# EAGLE design Kappa R1 (EAGLE 9.2.2)

## Sheet 1 of 2
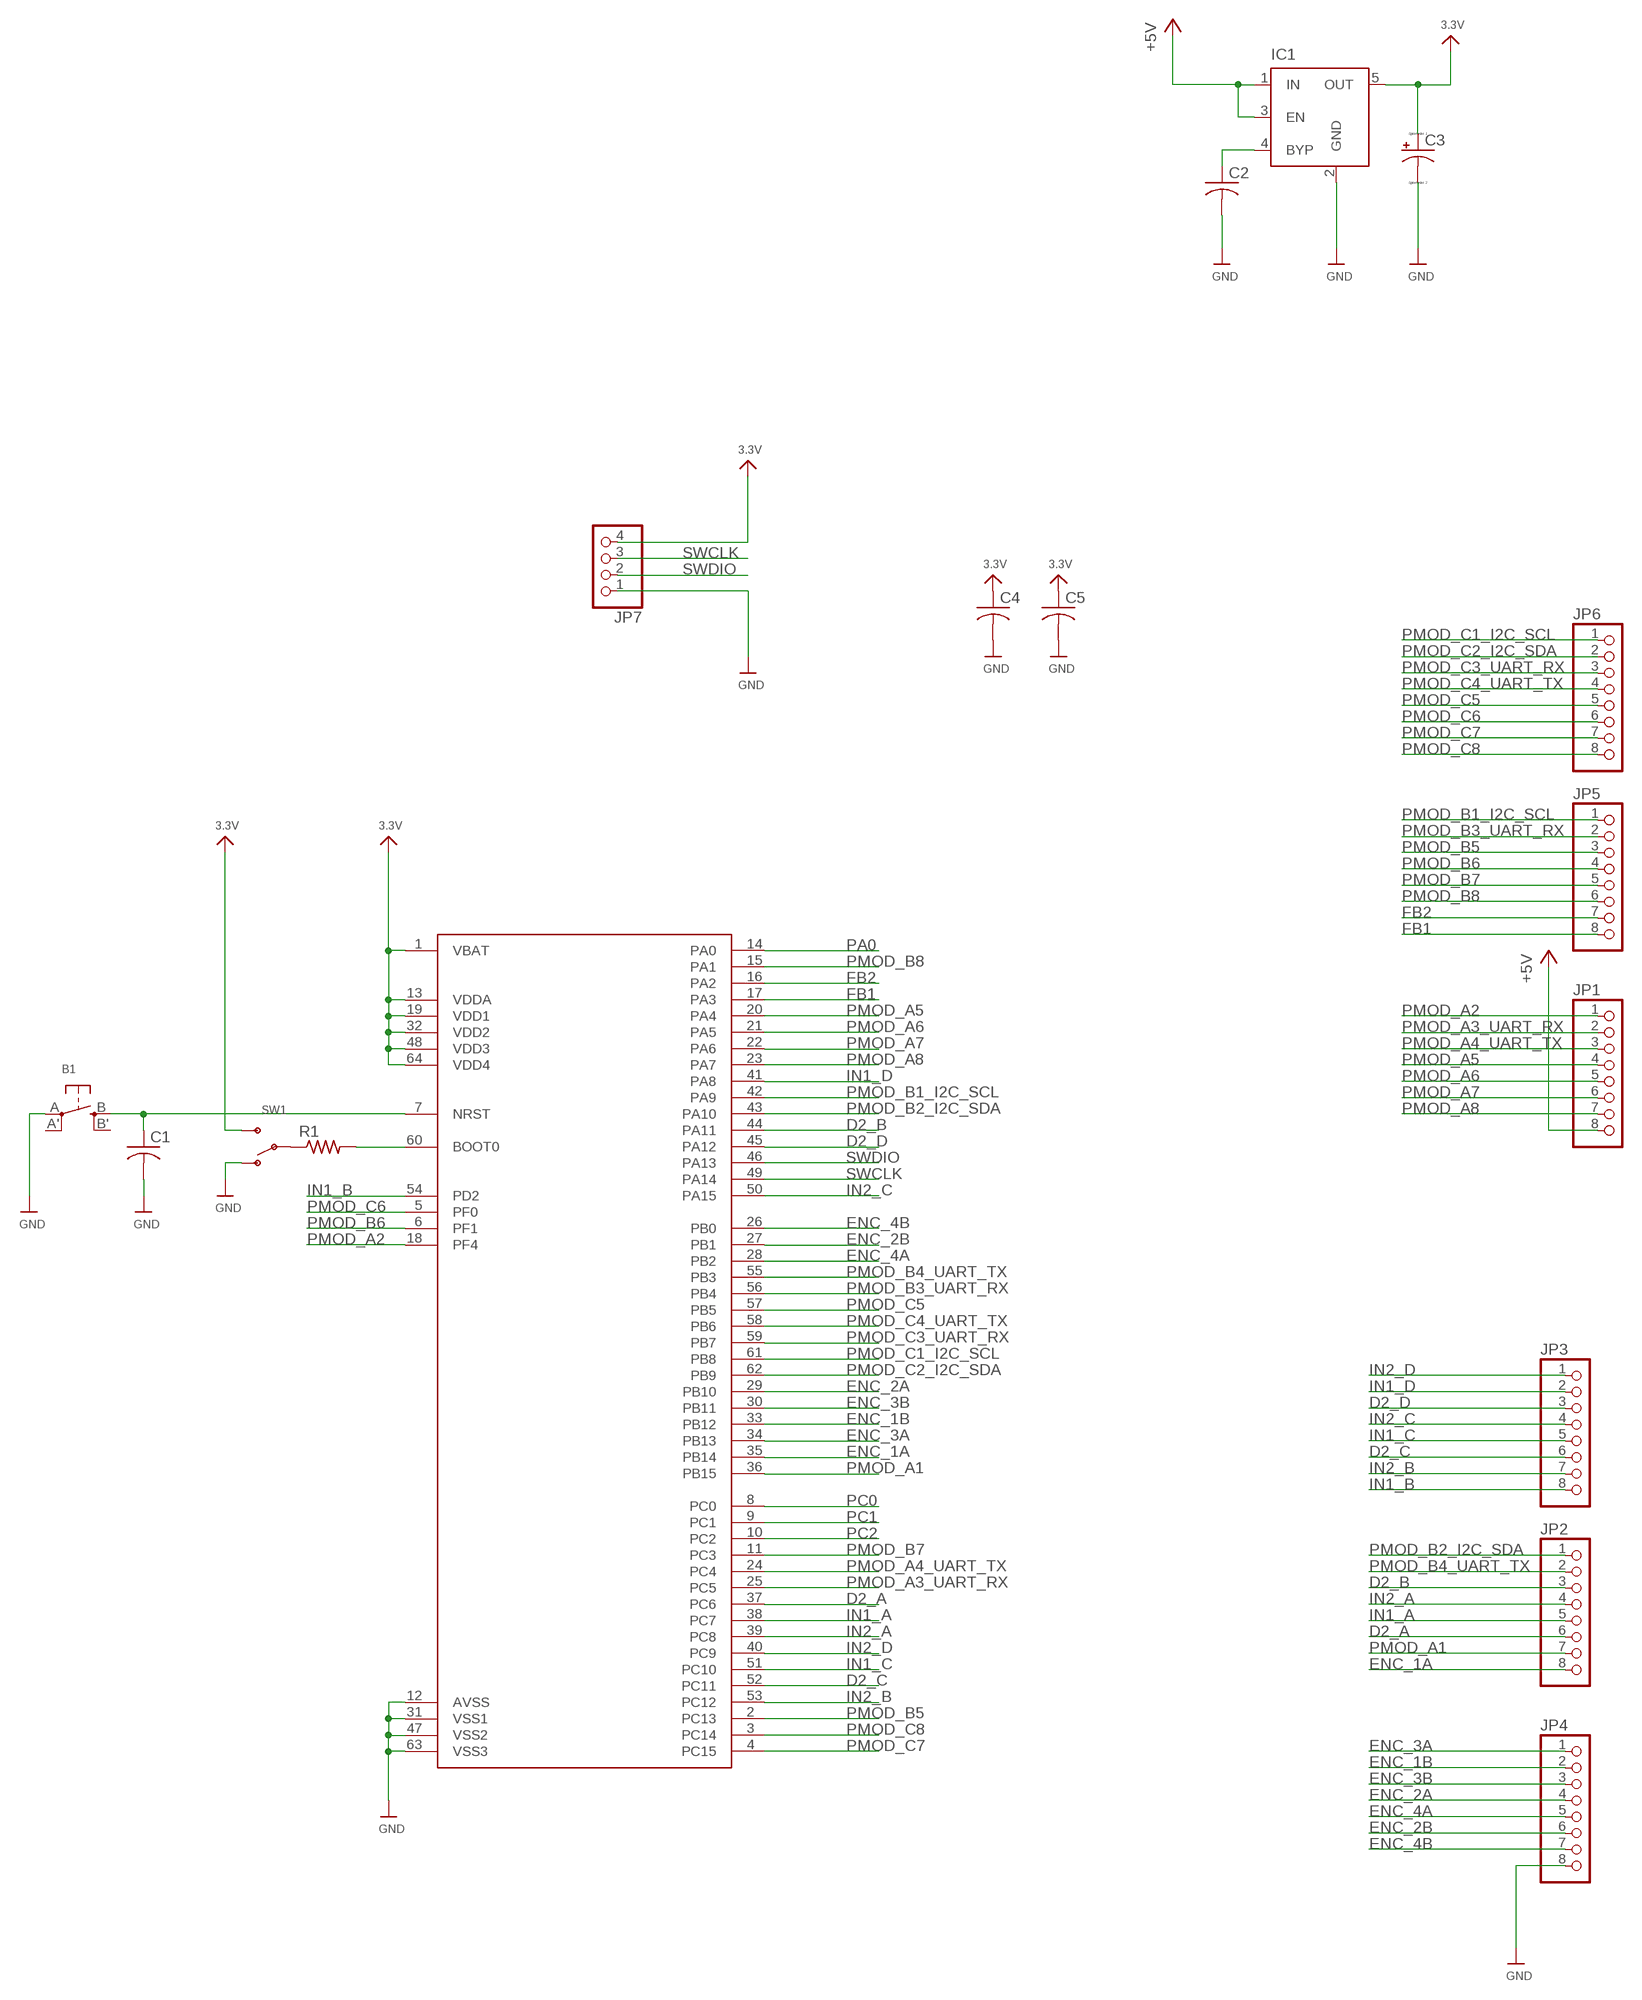
[diagram p0: schematic, sheet 1]

### Parts
B1  SWITCH_TACT_SMT4.6X2.8  [BTN_KMR2_4.6X2.8]
C1  C-USC0805K  [C0805K]
C2  C-USC0805K  [C0805K]
C3  CPOL-USCT3216  [CT3216]
C4  C-USC0805  [C0805]
C5  C-USC0805  [C0805]
IC1  MIC5219XX  [SOT23-5]
JP1  HEADER-1X8ROUND  [1X08_ROUND]
JP2  HEADER-1X8ROUND  [1X08_ROUND]
JP3  HEADER-1X8ROUND  [1X08_ROUND]
JP4  HEADER-1X8ROUND  [1X08_ROUND]
JP5  HEADER-1X8ROUND  [1X08_ROUND]
JP6  HEADER-1X8ROUND  [1X08_ROUND]
JP7  HEADER-1X4ROUND  [1X04_ROUND]
R1  R-US_R0805  [R0805]
SW1  SWITCH_SPDT  [SPDT_SMT_SSSS811101]
U$1  STM32F303  [LQFP64]

### Nets
3.3V: C3.-(+) C4.1 C5.1 IC1.5(OUT) JP7.4 SW1.C(S) U$1.1(VBAT) U$1.13(VDDA) U$1.19(VDD1) U$1.32(VDD2) U$1.48(VDD3) U$1.64(VDD4)
+5V: IC1.1(IN) IC1.3(EN) JP1.8
D2_A: JP2.6 U$1.37(PC6)
D2_B: JP2.3 U$1.44(PA11)
D2_C: JP3.6 U$1.52(PC11)
D2_D: JP3.3 U$1.45(PA12)
ENC_1A: JP2.8 U$1.35(PB14)
ENC_1B: JP4.2 U$1.33(PB12)
ENC_2A: JP4.4 U$1.29(PB10)
ENC_2B: JP4.6 U$1.27(PB1)
ENC_3A: JP4.1 U$1.34(PB13)
ENC_3B: JP4.3 U$1.30(PB11)
ENC_4A: JP4.5 U$1.28(PB2)
ENC_4B: JP4.7 U$1.26(PB0)
FB1: JP5.8 U$1.17(PA3)
FB2: JP5.7 U$1.16(PA2)
GND: B1.A(P) C1.2 C2.2 C3.+(-) C4.2 C5.2 IC1.2(GND) JP4.8 JP7.1 SW1.A(O) U$1.12(AVSS) U$1.31(VSS1) U$1.47(VSS2) U$1.63(VSS3)
IN1_A: JP2.5 U$1.38(PC7)
IN1_B: JP3.8 U$1.54(PD2)
IN1_C: JP3.5 U$1.51(PC10)
IN1_D: JP3.2 U$1.41(PA8)
IN2_A: JP2.4 U$1.39(PC8)
IN2_B: JP3.7 U$1.53(PC12)
IN2_C: JP3.4 U$1.50(PA15)
IN2_D: JP3.1 U$1.40(PC9)
N$2: R1.2 U$1.60(BOOT0)
N$3: B1.B(S) C1.1 U$1.7(NRST)
N$4: R1.1 SW1.B(P)
N$9: C2.1 IC1.4(BYP)
PA0: U$1.14(PA0)
PC0: U$1.8(PC0)
PC1: U$1.9(PC1)
PC2: U$1.10(PC2)
PMOD_A1: JP2.7 U$1.36(PB15)
PMOD_A2: JP1.1 U$1.18(PF4)
PMOD_A3_UART_RX: JP1.2 U$1.25(PC5)
PMOD_A4_UART_TX: JP1.3 U$1.24(PC4)
PMOD_A5: JP1.4 U$1.20(PA4)
PMOD_A6: JP1.5 U$1.21(PA5)
PMOD_A7: JP1.6 U$1.22(PA6)
PMOD_A8: JP1.7 U$1.23(PA7)
PMOD_B1_I2C_SCL: JP5.1 U$1.42(PA9)
PMOD_B2_I2C_SDA: JP2.1 U$1.43(PA10)
PMOD_B3_UART_RX: JP5.2 U$1.56(PB4)
PMOD_B4_UART_TX: JP2.2 U$1.55(PB3)
PMOD_B5: JP5.3 U$1.2(PC13)
PMOD_B6: JP5.4 U$1.6(PF1)
PMOD_B7: JP5.5 U$1.11(PC3)
PMOD_B8: JP5.6 U$1.15(PA1)
PMOD_C1_I2C_SCL: JP6.1 U$1.61(PB8)
PMOD_C2_I2C_SDA: JP6.2 U$1.62(PB9)
PMOD_C3_UART_RX: JP6.3 U$1.59(PB7)
PMOD_C4_UART_TX: JP6.4 U$1.58(PB6)
PMOD_C5: JP6.5 U$1.57(PB5)
PMOD_C6: JP6.6 U$1.5(PF0)
PMOD_C7: JP6.7 U$1.4(PC15)
PMOD_C8: JP6.8 U$1.3(PC14)
SWCLK: JP7.3 U$1.49(PA14)
SWDIO: JP7.2 U$1.46(PA13)
Unconnected: B1.A'(P1) B1.B'(S1)

## Sheet 2 of 2

## Library data of the parts
B1 = microbuilder:SWITCH_TACT_SMT: SMT Tact Switches 6x6mm - Digikey: P12940SCT-ND KMR2 (4.6x2.8mm) - Digikey: 401-1426-1-ND EVQ-PQHB55 - Light Touch, 160GF (4.5x4.5mm) - Digikey: P8090SCT-ND
C1 C2 C4 C5 = resistor:C-US: CAPACITOR, American symbol
C3 = resistor:CPOL-US: POLARIZED CAPACITOR, American symbol
IC1 = v-reg-micrel:MIC5219XX: VOLTAGE REGULATOR; OC_FARNELL: unknown; OC_NEWARK: unknown
JP1-JP6 = microbuilder:HEADER-1X8: PIN HEADER
JP7 = microbuilder:HEADER-1X4: PIN HEADER
R1 = resistor:R-US_: RESISTOR, American symbol
SW1 = microbuilder:SWITCH_SPDT: Switch - SPDT SSSS811101 - Horizontal Two Position SMT, 0.3A 4V [Mouser: 688-SSSS811101]
U$1 = stm32f:STM32F303

## Board
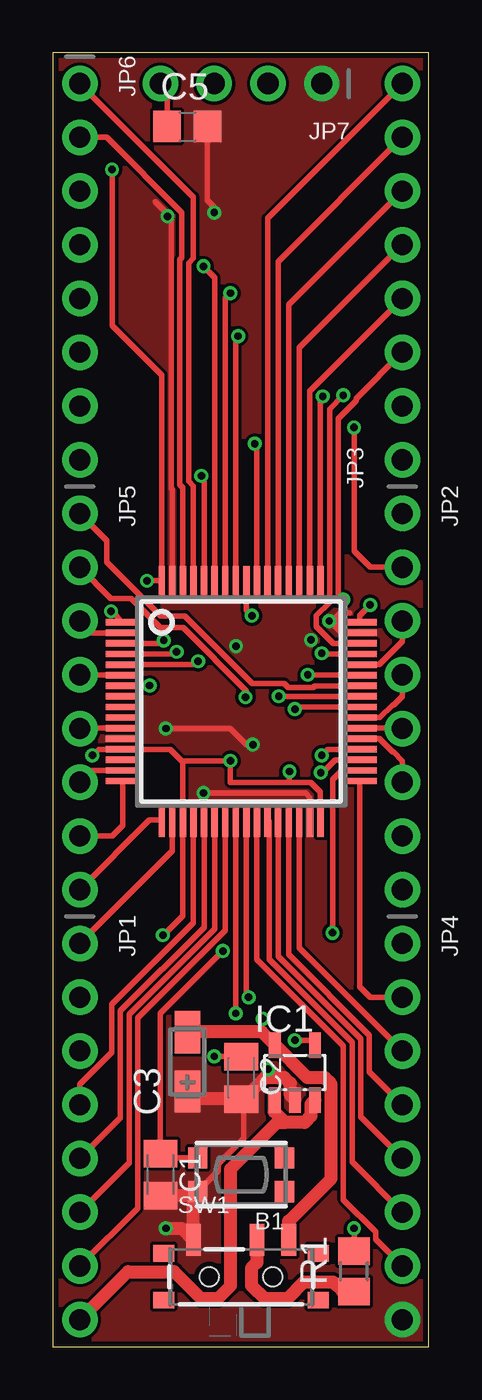
[diagram p1: board, top side]
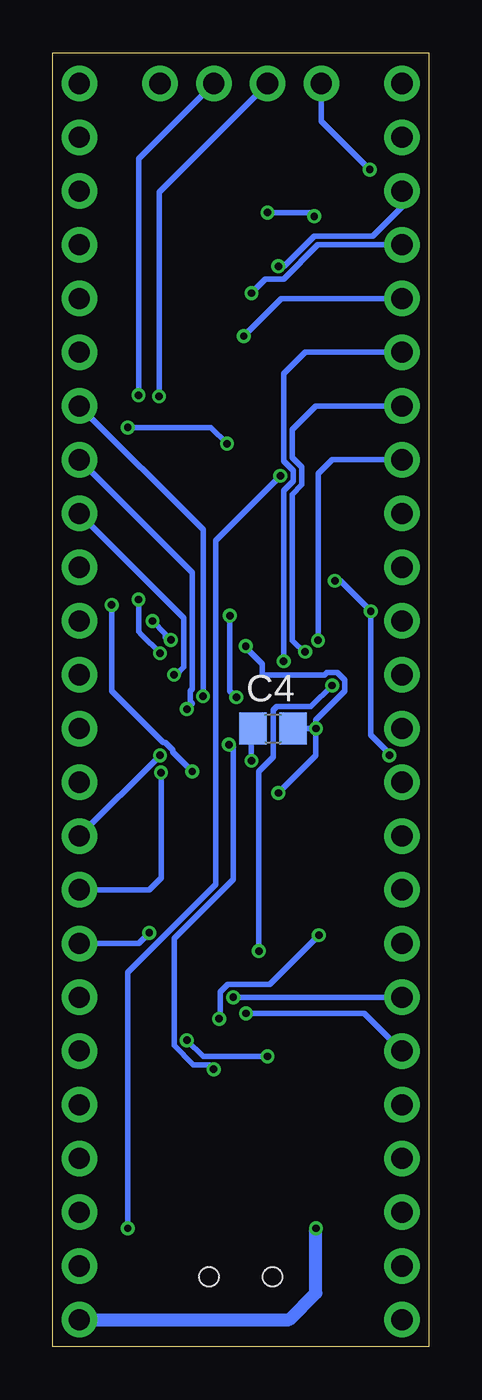
[diagram p2: board, bottom side, seen from below]

Size 17.76 x 61.14 mm. Coordinates in mm from the lower left corner, seen from the top.
Outline: 0,0 17.76,0 17.76,61.14 0,61.14 0,0
Copper layers (1*16): Top 0.035mm / dielectric 1.5mm / Bottom 0.035mm
Design rules "dirt_cheap_dirty_boards.v1.1": minimum track width 6mil, minimum drill 12mil, track to track 6mil, track to pad 6mil, pad to pad 6mil, via to via 6mil, smd to smd 0mil, copper to edge 10mil, drill to drill 10mil, minimum pad ring 10mil, minimum via ring 6mil, stop-mask expansion 2mil, vias tented up to drill 25mil, thermal gap 10mil

### Footprints (pad centres in the part's own frame; a part is rotated, then mirrored left to right if it is on the bottom)
BTN_KMR2_4.6X2.8 = smd 0.9 x 1: A 2.05,0.8; A' -2.05,0.8; B 2.05,-0.8; B' -2.05,-0.8
C0805K = smd 1.3 x 1.6: 1 -1,0; 2 1,0
CT3216 = smd 2 x 1.2: + -1.4,0; - 1.4,0
C0805 = smd 1.3 x 1.5: 1 -0.95,0; 2 0.95,0
SOT23-5 = smd 0.55 x 1.2: 1 -0.95,-1.3; 2 0,-1.3; 3 0.95,-1.3; 4 0.95,1.3; 5 -0.95,1.3
1X08_ROUND = drill 1 pad 1.676: 1 -8.89,0; 2 -6.35,0; 3 -3.81,0; 4 -1.27,0; 5 1.27,0; 6 3.81,0; 7 6.35,0; 8 8.89,0
1X04_ROUND = drill 1 pad 1.676: 1 -3.81,0; 2 -1.27,0; 3 1.27,0; 4 3.81,0
R0805 = smd 1.3 x 1.5: 1 -0.95,0; 2 0.95,0
SPDT_SMT_SSSS811101 = smd 0.7 x 1.5: A -2.25,1.75; B 0.75,1.75; C 2.25,1.75 | smd 1 x 0.8: SUP1 -3.65,1.1; SUP2 -3.65,-1.1; SUP3 3.65,1.1; SUP4 3.65,-1.1 | hole 0.9: -1.5,0; 1.5,0
LQFP64 = smd 1.6 x 0.3: 1 -5.6,3.75; 2 -5.6,3.25; 3 -5.6,2.75; 4 -5.6,2.25; 5 -5.6,1.75; 6 -5.6,1.25; 7 -5.6,0.75; 8 -5.6,0.25; 9 -5.6,-0.25; 10 -5.6,-0.75; 11 -5.6,-1.25; 12 -5.6,-1.75; 13 -5.6,-2.25; 14 -5.6,-2.75; 15 -5.6,-3.25; 16 -5.6,-3.75; 33 5.6,-3.75; 34 5.6,-3.25; 35 5.6,-2.75; 36 5.6,-2.25; 37 5.6,-1.75; 38 5.6,-1.25; 39 5.6,-0.75; 40 5.6,-0.25; 41 5.6,0.25; 42 5.6,0.75; 43 5.6,1.25; 44 5.6,1.75; 45 5.6,2.25; 46 5.6,2.75; 47 5.6,3.25; 48 5.6,3.75 | smd 0.3 x 1.6: 17 -3.75,-5.6; 18 -3.25,-5.6; 19 -2.75,-5.6; 20 -2.25,-5.6; 21 -1.75,-5.6; 22 -1.25,-5.6; 23 -0.75,-5.6; 24 -0.25,-5.6; 25 0.25,-5.6; 26 0.75,-5.6; 27 1.25,-5.6; 28 1.75,-5.6; 29 2.25,-5.6; 30 2.75,-5.6; 31 3.25,-5.6; 32 3.75,-5.6; 49 3.75,5.6; 50 3.25,5.6; 51 2.75,5.6; 52 2.25,5.6; 53 1.75,5.6; 54 1.25,5.6; 55 0.75,5.6; 56 0.25,5.6; 57 -0.25,5.6; 58 -0.75,5.6; 59 -1.25,5.6; 60 -1.75,5.6; 61 -2.25,5.6; 62 -2.75,5.6; 63 -3.25,5.6; 64 -3.75,5.6

### Placement (x,y rotation side)
B1  8.89,8.13 180 top
C1  5.08,8.13 270 top
C2  8.89,12.7 270 top
C3  6.35,13.46 90 top
C4  7.37,29.21 0 bottom
C5  6.35,57.66 0 top
IC1  11.43,12.95 0 top
JP1  1.27,10.16 270 top
JP2  16.51,30.48 270 top
JP3  16.51,50.8 90 top
JP4  16.51,10.16 270 top
JP5  1.27,30.48 270 top
JP6  1.27,50.8 270 top
JP7  8.89,59.69 180 top
R1  14.22,3.56 90 top
SW1  8.89,3.3 0 top
U$1  8.89,30.48 0 top

### Tracks (layer width: path | path; a pad name or v marks a point on that pad's centre or on a via)
3.3V  (via drill 0.35)
  Top 0.254: v4.44,36.19 5.03,36.19 U$1.64 5.14,45.91 2.79,48.26 v2.79,55.63 | v5.2,19.44 5.21,19.43 6.14,20.36 U$1.19 6.14,27.69 | v9.91,15.49 9.87,15.46 9.87,14.86 | U$1.32 12.64,26.22 12.19,26.67 11.18,26.67 | 6.14,27.69 v8.38,27.69 8.38,26.67 11.18,26.67 | C5.1 5.4,59.37 JP7.4 | U$1.48 14.49,34.56 v14.99,35.05 | v11.18,27.18 11.18,26.67 | v1.86,27.94 2.15,28.23 U$1.13 5.55,28.23 6.1,27.69 6.14,27.69 | U$1.1 2.77,34.75 v2.75,34.75
  Top 0.61: SW1.C 11.14,5.93 13.14,7.93 13.14,12.41 12.84,12.71 12.02,12.71 IC1.5 9.87,14.86 C3.-
  Bottom 0.254: v4.44,36.19 4.19,36.19 v2.75,34.75 2.75,28.91 1.78,27.94 v1.86,27.94 | JP7.4 5.08,57.91 v2.79,55.63 | v5.2,19.44 7.52,17.12 9.49,17.12 9.85,16.76 9.85,15.55 v9.91,15.49 | C4.1 8.38,29.14 v8.38,27.69 | v14.99,35.05 14.99,30.99 12.54,28.55 12.45,28.55 12.09,28.19 12.09,28.09 v11.18,27.18
+5V
  Top 0.254: IC1.1 10.45,11.68 10.45,11.95
  Top 0.61: 10.97,10.6 11.89,10.6 12.19,10.89 12.19,11.47 IC1.3 | 10.97,10.6 10.45,11.11 10.45,11.95 | 10.97,10.6 10.6,10.6 8.4,8.4 8.4,2.88 7.81,2.29 6.97,2.29 5.72,3.54 3.54,3.54 JP1.8
D2_A
  Top 0.254: U$1.37 15.41,28.73 16.05,28.09 16.1,28.09 16.51,27.69 JP2.6
D2_B
  Top 0.254: U$1.44 15.41,32.23 16.51,33.33 JP2.3
D2_C
  Top 0.254: U$1.52 11.14,49.24 JP3.6
D2_D  (via drill 0.35)
  Top 0.254: JP3.3 14.32,44.8 14.32,44.71 13.48,43.86 13.48,35.55 v13.72,35.31 | v12.7,32.77 12.74,32.73 U$1.45
  Bottom 0.254: v13.72,35.31 13.72,33.78 13.59,33.66 v12.7,32.77
ENC_1A  (via drill 0.35)
  Top 0.254: U$1.35 13.35,27.73 12.75,27.13 v12.65,27.13
  Bottom 0.254: v12.65,27.13 12.65,22.15 13.21,21.59 JP2.8
ENC_1B
  Top 0.254: U$1.33 14.49,17.01 14.99,16.51 JP4.2
ENC_2A
  Top 0.254: U$1.29 11.14,18.52 14.95,14.72 14.95,12.99 JP4.4
ENC_2B
  Top 0.254: U$1.27 10.21,24.81 10.21,18.3 14.13,14.38 14.13,8.73 JP4.6
ENC_3A  (via drill 0.35)
  Top 0.254: U$1.34 13.64,27.23 13.21,26.79 v13.21,19.56
  Bottom 0.254: JP4.1 13.72,19.05 v13.21,19.56
ENC_3B
  Top 0.254: JP4.3 11.64,18.84 U$1.30
ENC_4A
  Top 0.254: JP4.5 14.54,10.86 14.54,14.55 10.64,18.45 U$1.28
ENC_4B
  Top 0.254: JP4.7 15.25,5.07 15.25,5.42 13.73,6.94 13.73,14.21 9.64,18.3 U$1.26
FB1
  Top 0.254: JP5.8 4.56,24.88 U$1.17
FB2
  Top 0.254: U$1.16 3.29,24.63 2.79,24.13 JP5.7
GND  (via drill 0.35)
  Top 0.254: B1.A 7.82,8.3 7.82,8.64 9.01,9.83 9.01,11.7 | 13.41,33.96 13.41,34.5 13.57,34.66 14.02,34.66 | 10.94,12.71 10.57,12.71 v10.17,13.11 | v9.45,28.45 9.14,28.45 8.38,29.21 v5.33,29.21 | U$1.31 12.14,25.96 11.94,26.16 v7.11,26.16 | U$1.63 5.64,40.51 5.59,40.56 5.59,42.67 | 5.59,42.67 | 5.59,42.67 5.59,53.33 5.46,53.47 | 5.46,53.47 4.83,54.1 | C5.2 7.3,54.17 7.62,53.85 v7.62,53.59 | 5.46,53.47 v5.41,53.42 | U$1.47 14.42,33.8 13.57,33.8 13.41,33.96 | 13.41,33.96 13.09,34.29 v13.05,34.29 | 12.95,34.29 v13.05,34.29 | v13.05,34.29
  Top 0.61: B1.A 6.64,7.13 | 6.64,7.13 C1.2 | 6.64,7.13 SW1.A 6.1,5.59 v5.33,5.59 | C3.+ 6.71,11.7 C2.2 9.01,11.7 10.02,12.71 10.94,12.71 11.21,12.44 11.21,11.87 IC1.2
  Bottom 0.254: C4.2 v5.33,29.21 | v10.17,13.11 10.37,13.31 11.12,13.31 12.04,14.23 12.04,19.3 9.24,22.09 9.24,28.45 v9.45,28.45 | v7.11,26.16 5.33,27.94 v5.33,29.21 | v5.41,53.42 5.59,53.59 v7.62,53.59 | v13.05,34.29 12.45,33.68 12.45,33.53 12.31,33.4 v12.19,33.4 | v5.33,29.21 5.33,29.62 3.96,30.99 3.96,31.49 4.32,31.85 4.82,31.85 4.92,31.75 7.87,31.75 7.87,32.26 8.72,33.1 v8.65,33.1
  Bottom 0.61: JP4.8 6.6,1.27 5.33,2.54 v5.33,5.59
  pour Top (no thermals): 0,61.21 17.78,61.21 17.78,0 0,0
IN1_A
  Top 0.254: U$1.38 16.49,29.23 JP2.5
IN1_B
  Top 0.254: U$1.54 10.14,53.32 JP3.8
IN1_C
  Top 0.254: U$1.51 11.64,47.2 JP3.5
IN1_D  (via drill 0.35)
  Top 0.254: U$1.41 v10.67,30.73
  Bottom 0.254: JP3.2 10.67,38.61 v10.67,30.73
IN2_A
  Top 0.254: U$1.39 15.45,29.73 16.05,30.33 16.1,30.33 16.51,30.73 JP2.4
IN2_B
  Top 0.254: U$1.53 10.64,51.28 JP3.7
IN2_C
  Top 0.254: U$1.50 12.14,45.16 JP3.4
IN2_D  (via drill 0.35)
  Top 0.254: U$1.40 11.53,30.23 v11.43,30.13
  Bottom 0.254: JP3.1 11.43,36.83 11.18,36.58 11.18,31.08 11.28,30.98 11.28,30.48 11.18,30.38 v11.43,30.13
N$2  (via drill 0.35)
  Top 0.254: v14.22,5.59 R1.2 | U$1.60 7.14,41.02 v7.01,41.15
  Bottom 0.254: v7.01,41.15 10.06,38.1 10.06,21.85 14.22,17.68 v14.22,5.59
N$3  (via drill 0.35)
  Top 0.254: B1.B 5.28,8.93 C1.1 5.08,15.75 v8.03,18.69 | v4.57,31.24 3.3,31.24 U$1.7
  Bottom 0.254: v8.03,18.69 8.03,27.18 7.34,27.86 7.34,30.08 7.18,30.24 5.58,30.24 v4.57,31.24
N$4
  Top 0.61: R1.1 13.68,2.61 13.23,3.06 11.85,3.06 11.09,2.29 9.97,2.29 9.38,2.88 9.38,3.72 9.64,3.98 SW1.B
N$9  (via drill 0.35)
  Top 0.254: C2.1 8.87,13.72 v7.62,13.72 | v11.43,14.48 12.16,14.48 IC1.4
  Bottom 0.254: v7.62,13.72 10.67,13.72 v11.43,14.48
PMOD_A1  (via drill 0.35)
  Top 0.254: U$1.36 12.99,28.23 v12.7,27.94
  Bottom 0.254: JP2.7 v12.7,27.94
PMOD_A2
  Top 0.254: U$1.18 5.64,23.42 JP1.1
PMOD_A3_UART_RX  (via drill 0.35)
  Top 0.254: U$1.25 9.14,16.61 v9.24,16.51
  Bottom 0.254: v9.24,16.51 JP1.2
PMOD_A4_UART_TX  (via drill 0.35)
  Top 0.254: v8.64,15.75 U$1.24
  Bottom 0.254: JP1.3 3.05,15.75 v8.64,15.75
PMOD_A5
  Top 0.254: JP1.4 1.27,12.39 2.78,13.9 2.78,16.17 6.64,20.03 U$1.20
PMOD_A6
  Top 0.254: U$1.21 7.14,19.81 3.19,15.86 3.19,10.81 JP1.5
PMOD_A7
  Top 0.254: JP1.6 3.59,8.67 3.59,15.69 7.64,19.74 U$1.22
PMOD_A8
  Top 0.254: U$1.23 8.14,19.66 4,15.52 4,6.54 JP1.7
PMOD_B1_I2C_SCL
  Top 0.254: U$1.42 12.38,31.23 12.29,31.14 11.12,31.14 10.92,31.34 9.43,31.34 6.24,34.53 5.09,34.53 2.54,37.09 2.54,38.1 JP5.1
PMOD_B2_I2C_SDA  (via drill 0.35)
  Top 0.254: U$1.43 12.06,31.73 v12.04,31.75
  Bottom 0.254: v12.04,31.75 11.94,31.75 11.58,32.11 11.58,34.44 JP2.1
PMOD_B3_UART_RX  (via drill 0.35)
  Top 0.254: U$1.56 9.14,34.8 v9.4,34.54 | JP5.2 2.74,35.36 3.69,35.36 5.07,33.98 6.15,33.98 9.14,30.99 9.14,30.73 v9.1,30.69
  Bottom 0.254: v9.1,30.69 9.4,30.99 v9.4,34.54
PMOD_B4_UART_TX  (via drill 0.35)
  Top 0.254: U$1.55 9.64,42.66 9.65,42.67 v9.53,42.67 | v14.22,43.43 14.22,37.59 14.99,36.83 JP2.2
  Bottom 0.254: v9.53,42.67 10.29,43.43 v14.22,43.43
PMOD_B5
  Top 0.254: U$1.2 1.83,33.73 JP5.3
PMOD_B6
  Top 0.254: U$1.6 1.29,31.73 JP5.4
PMOD_B7
  Top 0.254: U$1.11 1.29,29.23 JP5.5
PMOD_B8
  Top 0.254: U$1.15 1.83,27.23 JP5.6
PMOD_C1_I2C_SCL
  Top 0.254: JP6.1 6.64,54.32 6.64,51.44 6.41,51.21 6.41,40.9 6.64,40.66 U$1.61
PMOD_C2_I2C_SDA
  Top 0.254: JP6.2 2.54,57.15 6.1,53.59 6.1,51.47 6,51.38 6,40.73 6.14,40.59 U$1.62
PMOD_C3_UART_RX  (via drill 0.35)
  Top 0.254: U$1.59 7.64,50.53 v7.11,51.05
  Bottom 0.254: JP6.3 1.27,53.85 2.64,52.48 5.41,52.48 6.83,51.05 v7.11,51.05
PMOD_C4_UART_TX  (via drill 0.35)
  Top 0.254: v8.38,49.78 8.14,49.54 U$1.58
  Bottom 0.254: v8.38,49.78 7.72,50.45 6.86,50.45 5.24,52.07 JP6.4
PMOD_C5  (via drill 0.35)
  Top 0.254: U$1.57 8.64,47.65 v8.75,47.75
  Bottom 0.254: JP6.5 6.97,49.53 v8.75,47.75
PMOD_C6  (via drill 0.35)
  Top 0.254: v6.86,32.38 6.7,32.23 U$1.5
  Bottom 0.254: v6.86,32.38 6.86,40.45 6.41,40.9 6.41,41.4 6.86,41.85 6.86,45.97 5.84,46.99 JP6.6
PMOD_C7  (via drill 0.35)
  Top 0.254: v5.84,32.84 5.74,32.73 U$1.4
  Bottom 0.254: JP6.7 5.33,44.45 6.45,43.33 6.45,42.02 6,41.57 6,40.73 6.45,40.28 6.45,33.38 5.84,32.77 v5.84,32.84
PMOD_C8  (via drill 0.35)
  Top 0.254: U$1.3 5.09,33.23 v5.24,33.37
  Bottom 0.254: v5.24,33.37 5.24,41.25 4.57,41.91 JP6.8
SWCLK  (via drill 0.35)
  Top 0.254: U$1.49 12.64,44.8 v12.75,44.91
  Bottom 0.254: v12.75,44.91 12.75,54.56 JP7.3
SWDIO  (via drill 0.35)
  Top 0.254: U$1.46 13.25,33.23 12.45,34.04 12.45,34.54 13.07,35.16 13.07,44.31 v13.72,44.96
  Bottom 0.254: v13.72,44.96 13.72,56.13 JP7.2